# EAGLE board usg-core (EAGLE 9.5.1), part 1 of 2
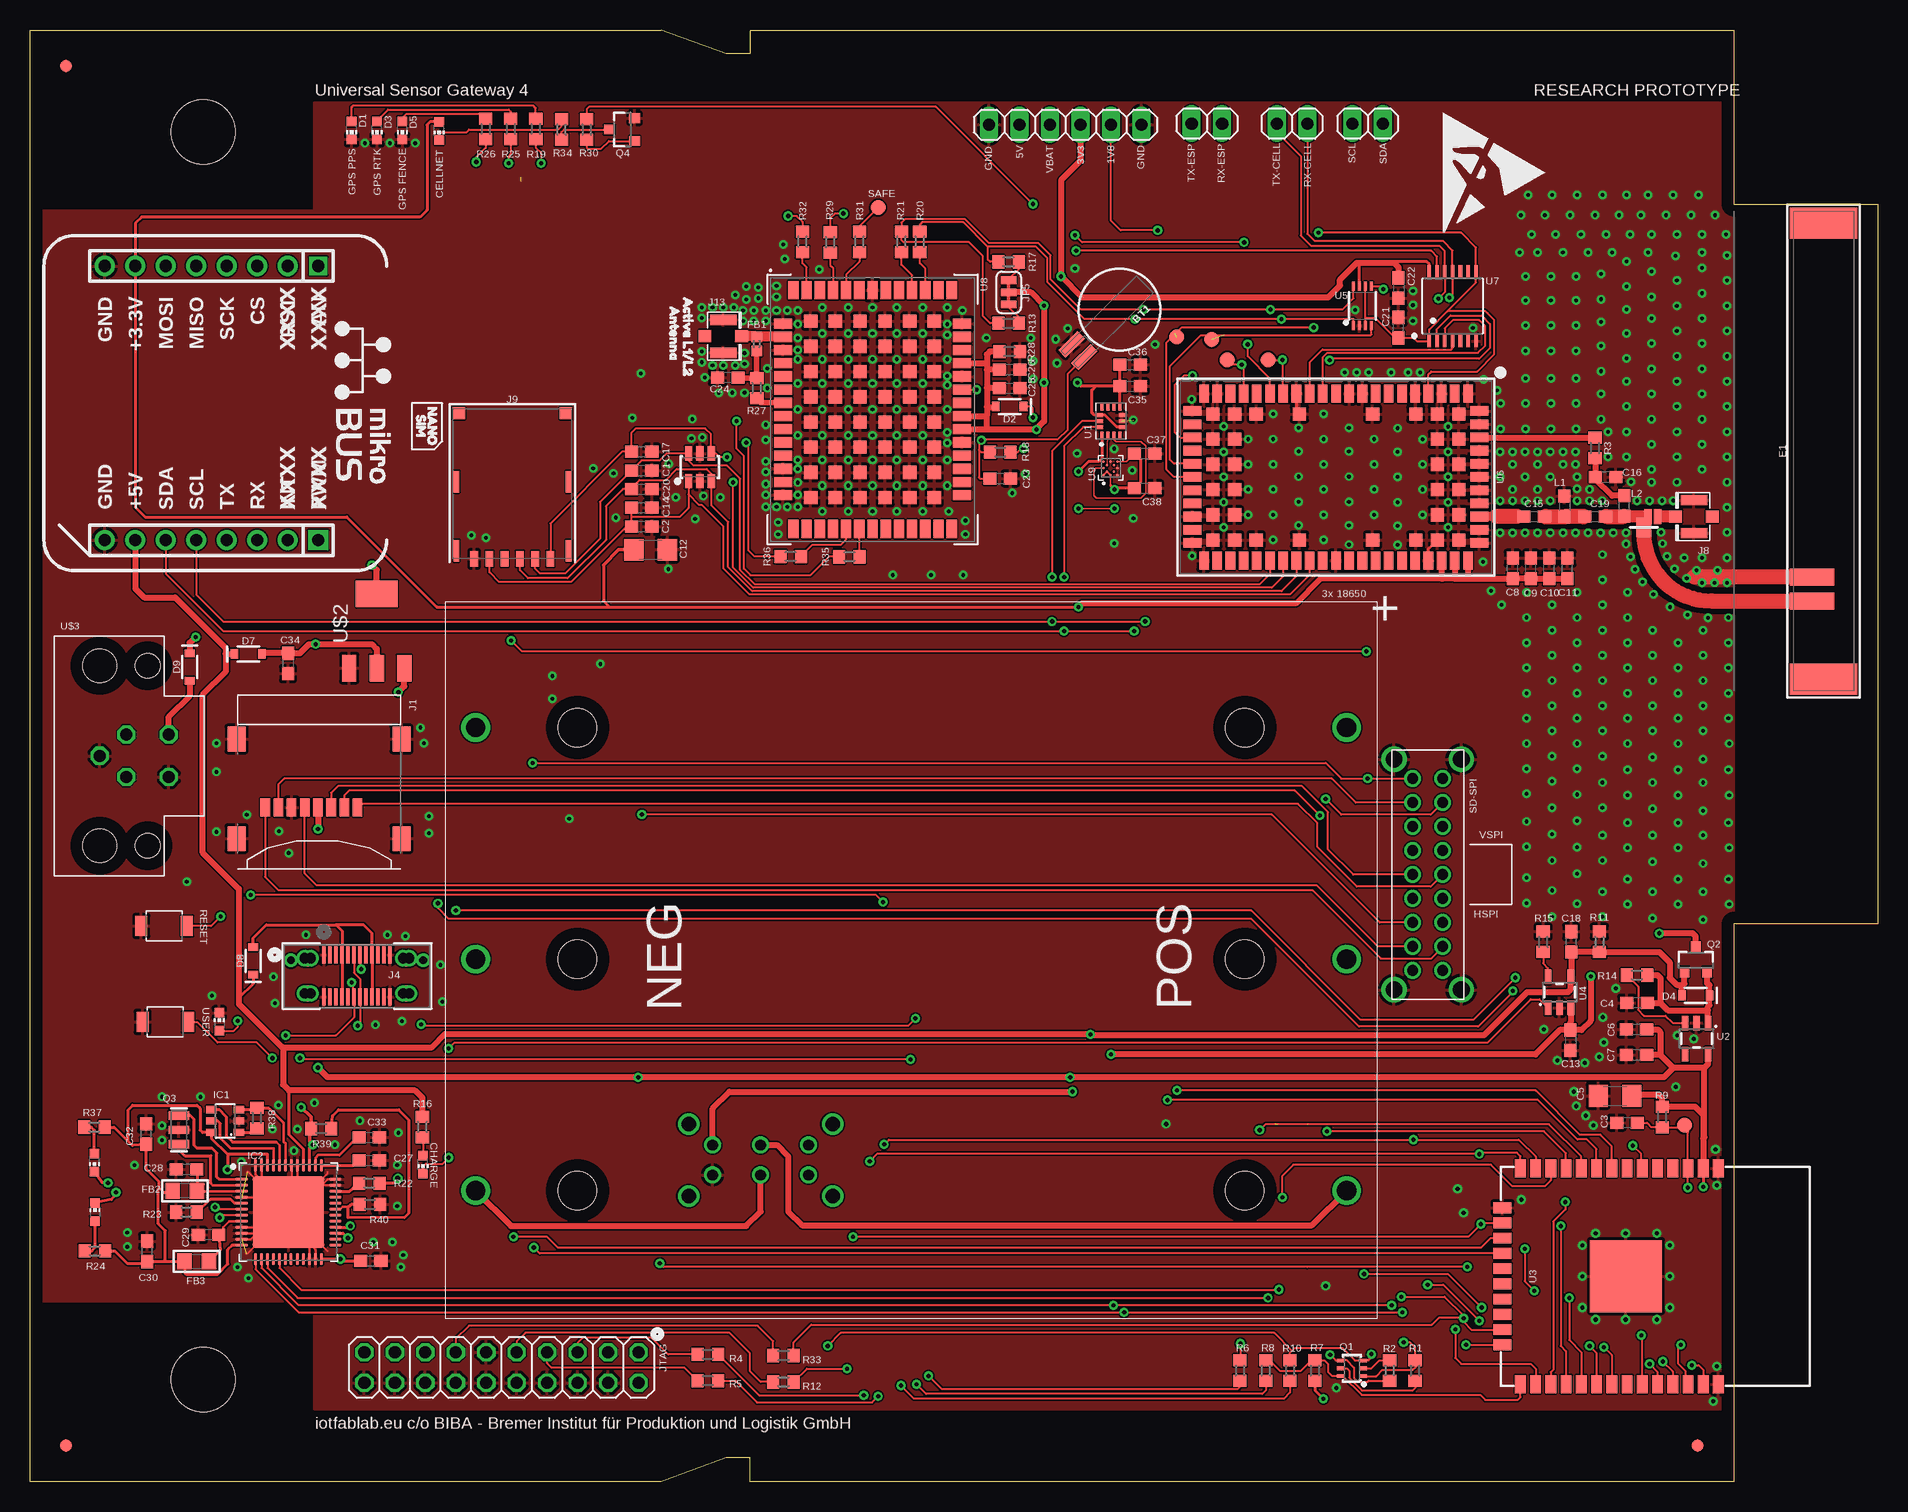
[diagram p3: board, top side]
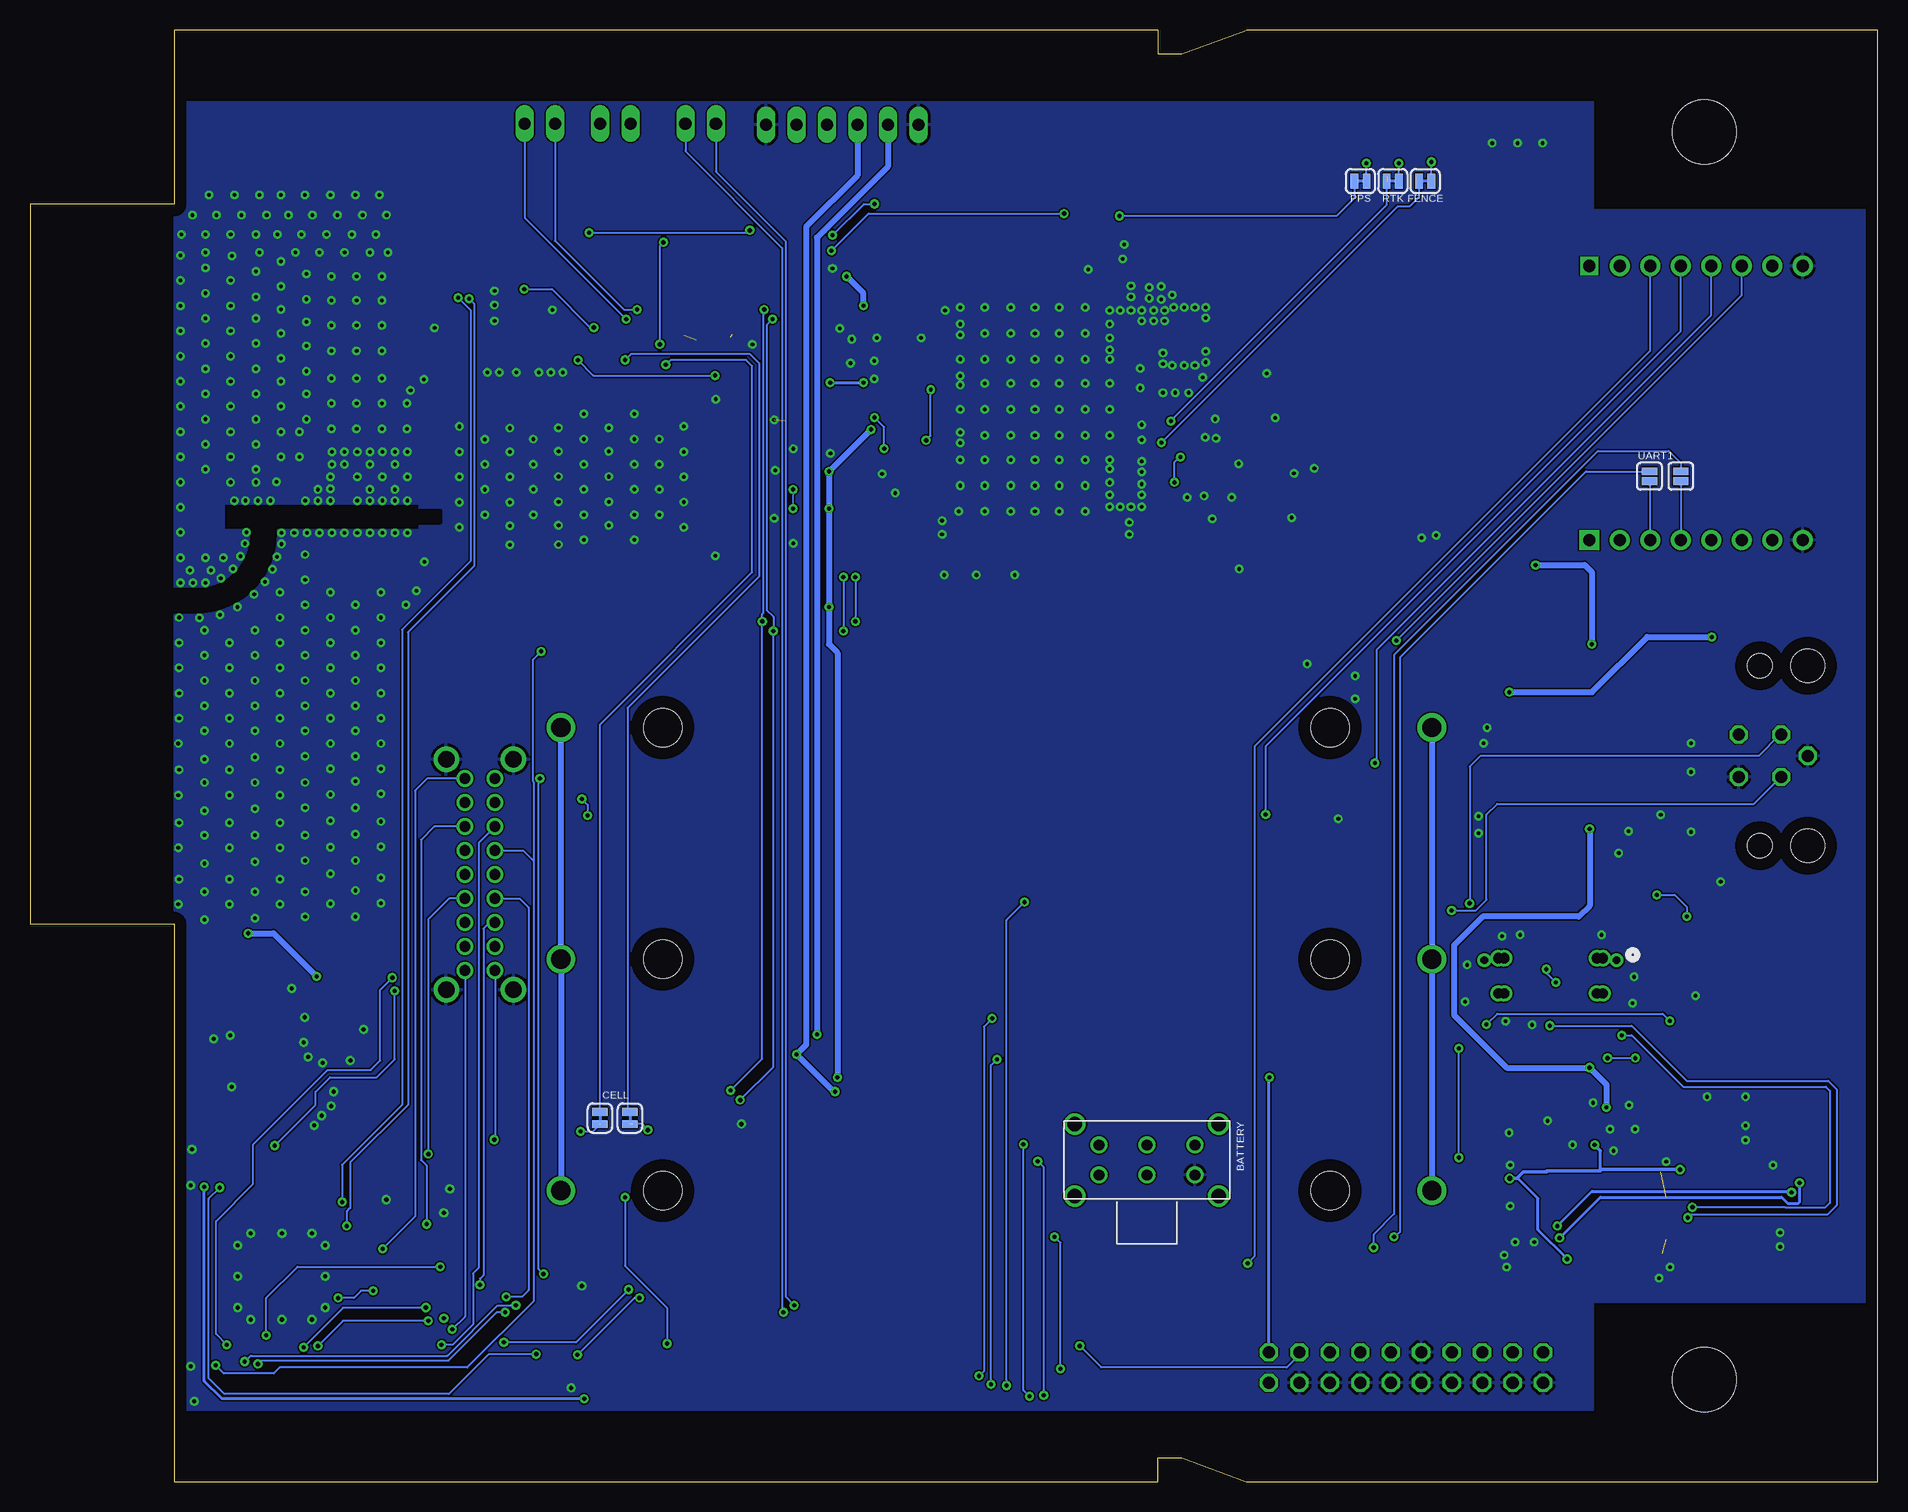
[diagram p4: board, bottom side, seen from below]

Size 154 x 121 mm. Coordinates in mm from the lower left corner, seen from the top.
Outline: 0,0 0,121 52.6,121 58,119.03 60,119.03 60,121 142,121 142,106.5 154,106.5 154,46.5 142,46.5 142,0 60,0 60,1.97 58,1.97 52.6,0 0,0
Copper layers (1*16): Top 0.035mm / dielectric 1.5mm / Bottom 0.035mm
Design rules "default *": minimum track width 3mil, minimum drill 0.3mm, track to track 5mil, track to pad 5mil, pad to pad 5mil, via to via 5mil, smd to smd 5mil, copper to edge 40mil, drill to drill 6mil, minimum pad ring 10mil, minimum via ring 8mil, stop-mask expansion 2.5mil, vias tented up to drill 20mil, thermal gap 10mil
Net classes: 1 USB_Data: width 0.127 mm, drill 0.254 mm; 2 3.3V: width 0.127 mm
Holes 5.32 mm at 14.45,8.5 14.45,112.5
tRestrict: area 56.9,94.7 to 58.3,96.2

## Footprints (pad centres in the part's own frame; a part is rotated, then mirrored left to right if it is on the bottom)
BK-18650-PC6 = drill 1.6: NEG1 75.15,29.755; NEG2 75.15,10.455; NEG3 75.15,49.055; POS1 2.55,29.755; POS2 2.55,10.455; POS3 2.55,49.055 | hole 3.2: 11.04,29.755; 66.66,29.755; 66.66,10.455; 11.04,10.455; 11.04,49.055; 66.66,49.055
SLIDE-SWITCH-DPDT = drill 1.2: MNT1 -3,-6; MNT2 3,-6; MNT3 -3,6; MNT4 3,6 | drill 0.9: P$1 -1.25,4; P$2 -1.25,0; P$3 -1.25,-4; P$4 1.25,4; P$5 1.25,0; P$6 1.25,-4
BATTCON-6.8MM = smd 2.25 x 0.85: + 4.87,0.75; - 4.87,-0.75
C0603 = smd 1.1 x 1: 1 -0.85,0; 2 0.85,0
C1206 = smd 1.6 x 1.8: 1 -1.4,0; 2 1.4,0
CHIP-LED0603 = smd 0.8 x 0.8: A 0,-0.75; C 0,0.75
SOD-323 = smd 0.63 x 0.83: A 1.15,0; C -1.15,0
SOT23-6L = smd 0.6 x 1.2: 1 -0.95,-1.15; 2 0,-1.15; 3 0.95,-1.15; 4 0.95,1.15; 5 0,1.15; 6 -0.95,1.15
MOLEX_146200 = smd 1.4 x 3.7: FEED 12.5,-0.95; GND 10.5,-0.95 | smd 2.6 x 5.6: MNT1 -19,0; MNT2 19,0
0402 = smd 0.85 x 0.9: 1 -0.58,0; 2 0.58,0
_0805 = smd 1.2 x 1.3: 1 -1.016,0; 2 1.016,0
FIDUCIAL-1X2 = smd 1 x 1: 1 0,0
SMT-JUMPER_2_NC_TRACE_SILK = smd 0.635 x 1.27: 1 -0.508,0; 2 0.508,0
1X02 = drill 1.016 long: 1 -1.27,0; 2 1.27,0
SOT23-6 = smd 0.6 x 0.9: 1 -0.95,-1.15; 2 0,-1.15; 3 0.95,-1.15; 4 0.95,1.15; 5 0,1.15; 6 -0.95,1.15
QFN48_8MM = smd 1 x 0.23: 1 -3.9,2.75; 2 -3.9,2.25; 3 -3.9,1.75; 4 -3.9,1.25; 5 -3.9,0.75; 6 -3.9,0.25; 7 -3.9,-0.25; 8 -3.9,-0.75; 9 -3.9,-1.25; 10 -3.9,-1.75; 11 -3.9,-2.25; 12 -3.9,-2.75; 25 3.9,-2.75; 26 3.9,-2.25; 27 3.9,-1.75; 28 3.9,-1.25; 29 3.9,-0.75; 30 3.9,-0.25; 31 3.9,0.25; 32 3.9,0.75; 33 3.9,1.25; 34 3.9,1.75; 35 3.9,2.25; 36 3.9,2.75 | smd 0.23 x 1: 13 -2.75,-3.9; 14 -2.25,-3.9; 15 -1.75,-3.9; 16 -1.25,-3.9; 17 -0.75,-3.9; 18 -0.25,-3.9; 19 0.2,-3.9; 20 0.75,-3.9; 21 1.25,-3.9; 22 1.75,-3.9; 23 2.25,-3.9; 24 2.75,-3.9; 37 2.75,3.9; 38 2.25,3.9; 39 1.75,3.9; 40 1.25,3.9; 41 0.75,3.9; 42 0.25,3.9; 43 -0.25,3.9; 44 -0.75,3.9; 45 -1.25,3.9; 46 -1.75,3.9; 47 -2.25,3.9; 48 -2.75,3.9 | smd 6 x 6: THERMAL 0,0
MOLEX_47219-2001 = smd 0.8 x 1.5: 1 3.2,-2.1; 2 2.1,-2.1; 3 1,-2.1; 4 -0.1,-2.1; 5 -1.2,-2.1; 6 -2.3,-2.1; 7 -3.4,-2.1; 8 -4.5,-2.1 | smd 1.5 x 2.05: G1 6.875,-4.7; G2 6.875,3.6; G3 -6.875,3.6; G4 -6.875,-4.7
CONN_DX07S024WJ3R400 = drill 0.635 pad 0.635: 25 -8.255,3.048; 26 2.769,3.048 | smd 1.858 x 1.358: 27 -6.85,3.22; 28 1.35,3.22; 29 -6.85,0.28; 30 1.35,0.28 | drill 0.838 pad 0.838: 31 -7.112,3.226; 32 -6.604,3.226; 33 1.092,3.226; 34 1.6,3.226; 35 -7.112,0.279; 36 -6.604,0.279; 37 1.092,0.279; 38 1.6,0.279 | smd 0.305 x 1.397: A1 -5.5,3.5; A2 -5,3.5; A3 -4.5,3.5; A4 -4,3.5; A5 -3.5,3.5; A6 -3,3.5; A7 -2.5,3.5; A8 -2,3.5; A9 -1.5,3.5; A10 -1,3.5; A11 -0.5,3.5; A12 0,3.5; B1 0,0; B2 -0.5,0; B3 -1,0; B4 -1.5,0; B5 -2,0; B6 -2.5,0; B7 -3,0; B8 -3.5,0; B9 -4,0; B10 -4.5,0; B11 -5,0; B12 -5.5,0
U.FL = smd 2.2 x 0.85: 1 0,1.375; 2 0,-1.375 | smd 1.05 x 1: FEED 1.525,0; NC -1.525,0
NANO_SIM_WURTH_693043020611 = smd 0.65 x 1.3: C1 1.905,6.25; C2 -0.635,6.25; C3 -1.905,6.25; C5 3.175,6.25; C6 0.635,6.25; C7 -3.175,6.25 | smd 0.48 x 1.8: MNT1 -4.69,5.58; MNT2 4.66,5.58; MNT3 -4.69,-0.17; MNT4 4.66,-0.17 | smd 1.03 x 1: MNT5 -4.465,-5.89; MNT6 4.465,-5.89
SMT-JUMPER_3_2-NC_TRACE_SILK = smd 0.635 x 1.27: 1 -1.016,0; 2 0,0; 3 1.016,0
SMT-JUMPER_2_NC_TRACE_NO-SILK = smd 0.635 x 1.27: 1 -0.508,0; 2 0.508,0
SMT-JUMPER_2_NO_NO-SILK = smd 0.635 x 1.27: 1 -0.406,0; 2 0.406,0
2X10 = drill 1.016 octagon: 1 -11.43,-1.27; 2 -11.43,1.27; 3 -8.89,-1.27; 4 -8.89,1.27; 5 -6.35,-1.27; 6 -6.35,1.27; 7 -3.81,-1.27; 8 -3.81,1.27; 9 -1.27,-1.27; 10 -1.27,1.27; 11 1.27,-1.27; 12 1.27,1.27; 13 3.81,-1.27; 14 3.81,1.27; 15 6.35,-1.27; 16 6.35,1.27; 17 8.89,-1.27; 18 8.89,1.27; 19 11.43,-1.27; 20 11.43,1.27
0603 = smd 1.1 x 1: 1 -0.85,0; 2 0.85,0
MIKROBUS = drill 1.016 square: 1 -11.43,7.62 | drill 1.016 pad 1.676: 2 -11.43,5.08; 3 -11.43,2.54; 4 -11.43,0; 5 -11.43,-2.54; 6 -11.43,-5.08; 7 -11.43,-7.62; 8 -11.43,-10.16; 9 11.43,-10.16; 10 11.43,-7.62; 11 11.43,-5.08; 12 11.43,-2.54; 13 11.43,0; 14 11.43,2.54; 15 11.43,5.08 | drill 1.016 pad 1.676 square: 16 11.43,7.62
1X06 = drill 1.016 long: 1 -6.35,0; 2 -3.81,0; 3 -1.27,0; 4 1.27,0; 5 3.81,0; 6 6.35,0
SC70-6 = smd 0.3 x 0.66: 1 -0.65,-0.92; 2 0,-0.92; 3 0.65,-0.92; 4 0.65,0.92; 5 0,0.92; 6 -0.65,0.92
SOT23-3@1 = smd 0.8 x 0.9: 1 -0.95,-1; 2 0.95,-1; 3 0,1.1
RESONATOR-SMD = smd 0.7 x 1.7: 1 -1.2,0; 2 0,0; 3 1.2,0
SOT23-3 = smd 0.8 x 0.9: 1 -0.95,-1; 2 0.95,-1; 3 0,1.1
R0603 = smd 1 x 1.1: 1 -0.85,0; 2 0.85,0
B1,27 = smd 1.27 x 1.27: TP 0,0
SLIDE-SWITCH-6PDT = drill 1.4: MNT1 -2.8,-9.6; MNT2 2.8,-9.6; MNT3 -2.8,9.6; MNT4 2.8,9.6 | drill 0.9: P$1 -1.25,-8; P$2 -1.25,-6; P$3 -1.25,-4; P$4 -1.25,-2; P$5 -1.25,0; P$6 -1.25,2; P$7 -1.25,4; P$8 -1.25,6; P$9 -1.25,8; P$10 1.25,-8; P$11 1.25,-6; P$12 1.25,-4; P$13 1.25,-2; P$14 1.25,0; P$15 1.25,2; P$16 1.25,4; P$17 1.25,6; P$18 1.25,8
SMT-JUMPER_2_NO_SILK = smd 0.635 x 1.27: 1 -0.406,0; 2 0.406,0
SW2-2.6-3.0X2.5X1.2+0.4MM = smd 1 x 1.7: 1 -1.9,0; 2 1.9,0
PQFN50P300X250X88-14N = smd 0.59 x 0.35: 1 -1.165,0.75; 2 -1.165,0.25; 3 -1.165,-0.25; 4 -1.165,-0.75; 8 1.165,-0.75; 9 1.165,-0.25; 10 1.165,0.25; 11 1.165,0.75 | smd 0.35 x 0.59: 5 -0.5,-0.915; 6 0,-0.915; 7 0.5,-0.915; 12 0.5,0.915; 13 0,0.915; 14 -0.5,0.915
SOT23-5 = smd 0.55 x 1.2: 1 -0.95,-1.3; 2 0,-1.3; 3 0.95,-1.3; 4 0.95,1.3; 5 -0.95,1.3
ESP-WROOM-32 = smd 0.9 x 1.5: 1 7.7,9; 2 6.43,9; 3 5.16,9; 4 3.89,9; 5 2.62,9; 6 1.35,9; 7 0.08,9; 8 -1.19,9; 9 -2.46,9; 10 -3.73,9; 11 -5,9; 12 -6.27,9; 13 -7.54,9; 14 -8.81,9; 25 -8.81,-9; 26 -7.54,-9; 27 -6.27,-9; 28 -5,-9; 29 -3.73,-9; 30 -2.46,-9; 31 -1.19,-9; 32 0.08,-9; 33 1.35,-9; 34 2.62,-9; 35 3.89,-9; 36 5.16,-9; 37 6.43,-9; 38 7.7,-9 | smd 1.5 x 0.9: 15 -10.3,5.715; 16 -10.3,4.445; 17 -10.3,3.175; 18 -10.3,1.905; 19 -10.3,0.635; 20 -10.3,-0.635; 21 -10.3,-1.905; 22 -10.3,-3.175; 23 -10.3,-4.445; 24 -10.3,-5.715 | smd 6 x 6: GND 0,0
VSSOP-8 = smd 0.75 x 0.25: 1 -1.65,0.75; 2 -1.65,0.25; 3 -1.65,-0.25; 4 -1.65,-0.75; 5 1.65,-0.75; 6 1.65,-0.25; 7 1.65,0.25; 8 1.65,0.75
SARA-LGA = smd 0.8 x 1.5: 1 -11,-6.95; 2 -9.9,-6.95; 3 -8.8,-6.95; 4 -7.7,-6.95; 5 -6.6,-6.95; 6 -5.5,-6.95; 7 -4.4,-6.95; 8 -3.3,-6.95; 9 -2.2,-6.95; 10 -1.1,-6.95; 11 0,-6.95; 12 1.1,-6.95; 13 2.2,-6.95; 14 3.3,-6.95; 15 4.4,-6.95; 16 5.5,-6.95; 17 6.6,-6.95; 18 7.7,-6.95; 19 8.8,-6.95; 20 9.9,-6.95; 21 11,-6.95; 33 11,6.95; 34 9.9,6.95; 35 8.8,6.95; 36 7.7,6.95; 37 6.6,6.95; 38 5.5,6.95; 39 4.4,6.95; 40 3.3,6.95; 41 2.2,6.95; 42 1.1,6.95; 43 0,6.95; 44 -1.1,6.95; 45 -2.2,6.95; 46 -3.3,6.95; 47 -4.4,6.95; 48 -5.5,6.95; 49 -6.6,6.95; 50 -7.7,6.95; 51 -8.8,6.95; 52 -9.9,6.95; 53 -11,6.95 | smd 1.5 x 0.8: 22 11.95,-5.5; 23 11.95,-4.4; 24 11.95,-3.3; 25 11.95,-2.2; 26 11.95,-1.1; 27 11.95,0; 28 11.95,1.1; 29 11.95,2.2; 30 11.95,3.3; 31 11.95,4.4; 32 11.95,5.5; 54 -11.95,5.5; 55 -11.95,4.4; 56 -11.95,3.3; 57 -11.95,2.2; 58 -11.95,1.1; 59 -11.95,0; 60 -11.95,-1.1; 61 -11.95,-2.2; 62 -11.95,-3.3; 63 -11.95,-4.4; 64 -11.95,-5.5 | smd 1.1 x 1.1: 65 -10.25,-5.25; 66 -10.25,-3.15; 67 -10.25,-1.05; 68 -10.25,1.05; 69 -10.25,3.15; 70 -10.25,5.25; 71 -8.45,-5.25; 72 -8.45,-3.15; 73 -8.45,-1.05; 74 -8.45,1.05; 75 -8.45,3.15; 76 -8.45,5.25; 77 -6.65,-5.25; 78 -6.65,5.25; 79 -3.05,-5.25; 80 -3.05,5.25; 81 3.05,-5.25; 82 3.05,5.25; 83 6.65,-5.25; 84 6.65,5.25; 85 8.45,-5.25; 86 8.45,-3.15; 87 8.45,-1.05; 88 8.45,1.05; 89 8.45,3.15; 90 8.45,5.25; 91 10.25,-5.25; 92 10.25,-3.15; 93 10.25,-1.05; 94 10.25,1.05; 95 10.25,3.15; 96 10.25,5.25
TSSOP14 = smd 0.305 x 0.991: 1 -1.95,-2.918; 2 -1.3,-2.918; 3 -0.65,-2.918; 4 0,-2.918; 5 0.65,-2.918; 6 1.3,-2.918; 7 1.95,-2.918; 8 1.95,2.918; 9 1.3,2.918; 10 0.65,2.918; 11 0,2.918; 12 -0.65,2.918; 13 -1.3,2.918; 14 -1.95,2.918
ZED-F9P = smd 0.85 x 1.52: 1 -7.15,-7.45; 2 -6.05,-7.45; 3 -4.95,-7.45; 4 -3.85,-7.45; 5 -2.75,-7.45; 6 -1.65,-7.45; 7 -0.55,-7.45; 8 0.55,-7.45; 9 1.65,-7.45; 10 2.75,-7.45; 11 3.85,-7.45; 12 4.95,-7.45; 13 6.05,-7.45; 14 7.15,-7.45; 28 7.15,7.45; 29 6.05,7.45; 30 4.95,7.45; 31 3.85,7.45; 32 2.75,7.45; 33 1.65,7.45; 34 0.55,7.45; 35 -0.55,7.45; 36 -1.65,7.45; 37 -2.75,7.45; 38 -3.85,7.45; 39 -4.95,7.45; 40 -6.05,7.45; 41 -7.15,7.45 | smd 1.52 x 0.85: 15 9.95,-6.6; 16 9.95,-5.5; 17 9.95,-4.4; 18 9.95,-3.3; 19 9.95,-2.2; 20 9.95,-1.1; 21 9.95,0; 22 9.95,1.1; 23 9.95,2.2; 24 9.95,3.3; 25 9.95,4.4; 26 9.95,5.5; 27 9.95,6.6; 42 -9.95,6.6; 43 -9.95,5.5; 44 -9.95,4.4; 45 -9.95,3.3; 46 -9.95,2.2; 47 -9.95,1.1; 48 -9.95,0; 49 -9.95,-1.1; 50 -9.95,-2.2; 51 -9.95,-3.3; 52 -9.95,-4.4; 53 -9.95,-5.5; 54 -9.95,-6.6 | smd 1.1 x 1.1: 55 -1.05,-1.05; 56 -3.15,-1.05; 57 -5.25,-1.05; 58 -7.35,-1.05; 59 -1.05,-3.1; 60 -3.15,-3.1; 61 -5.25,-3.1; 62 -7.35,-3.1; 63 -1.05,-5.15; 64 -3.15,-5.15; 65 -5.25,-5.15; 66 -7.35,-5.15; 67 -1.05,5.15; 68 -3.15,5.15; 69 -5.25,5.15; 70 -7.35,5.15; 71 -1.05,3.1; 72 -3.15,3.1; 73 -5.25,3.1; 74 -7.35,3.1; 75 -1.05,1.05; 76 -3.15,1.05; 77 -5.25,1.05; 78 -7.35,1.05; 79 1.05,1.05; 80 3.15,1.05; 81 5.25,1.05; 82 7.35,1.05; 83 1.05,3.1; 84 3.15,3.1; 85 5.25,3.1; 86 7.35,3.1; 87 1.05,5.15; 88 3.15,5.15; 89 5.25,5.15; 90 7.35,5.15; 91 1.05,-5.15; 92 3.15,-5.15; 93 5.25,-5.15; 94 7.35,-5.15; 95 1.05,-3.1; 96 3.15,-3.1; 97 5.25,-3.1; 98 7.35,-3.1; 99 1.05,-1.05; 100 3.15,-1.05; 101 5.25,-1.05; 102 7.35,-1.05
XDCR_BMM150 = smd 0.2 x 0.2: A1 -0.601,0.601; A3 -0.035,0.601; A5 0.531,0.601; B2 -0.318,0.318; B4 0.248,0.318; C1 -0.601,0.035; C5 0.531,0.035; D2 -0.318,-0.248; D4 0.248,-0.248; E1 -0.601,-0.531; E3 -0.035,-0.531; E5 0.531,-0.531
SOT223 = smd 3.5 x 2.2: P$1 0,3.1 | smd 1.2 x 2.2: P$2 -2.3,-3.1; P$3 0,-3.1; P$4 2.3,-3.1
SACC-CI-M12FSD-4CON-L90 = drill 1 octagon: PIN1 -1.77,9.57; PIN2 1.77,9.57; PIN3 1.77,6.03; PIN4 -1.77,6.03; SHIELD 0,3.8 | hole 2.8: -7.5,3.8; 7.5,3.8 | hole 2.05: -7.5,7.8; 7.5,7.8

## Placement (x,y rotation side)
BAT  3x 18650  [BK-18650-PC6]  112.3,73.3 180 top
BATTERY  SLIDE-SWITCH-DPDT  [SLIDE-SWITCH-DPDT]  60.9,26.8 270 bottom
BT1  6.8MM_COIN_CELL  [BATTCON-6.8MM]  90.8,97.7 225 top
C1  47pF  [C0603]  50.98,84.29 0 top
C2  0.1uF  [C0603]  50.98,79.62 0 top
C3  10uF  [C0603]  133.12,29.9 180 top
C4  1uF  [C0603]  133.95,39.91 180 top
C5  100uF  [C1206]  132.12,32.15 0 top
C6  1uF  [C0603]  133.91,37.68 180 top
C7  10uF  [C0603]  133.91,35.56 180 top
C8  0.1uF  [C0603]  123.59,76.12 90 top
C9  10nF  [C0603]  125.12,76.12 90 top
C10  15pF  [C0603]  126.64,76.12 90 top
C11  68pF  [C0603]  128.16,76.12 90 top
C12  100uF  [C1206]  51.73,77.68 0 top
C13  4.7uF  [C0603]  128.41,36.78 270 top
C14  47pF  [C0603]  50.98,81.18 0 top
C15  15pF  [C0603]  125.37,80.44 0 top
C16  27pF  [C0603]  131.34,83.74 0 top
C17  47pF  [C0603]  50.98,85.85 0 top
C18  4.7uF  [C0603]  128.47,44.99 90 top
C19  33pF  [C0603]  130.45,80.44 0 top
C20  47pF  [C0603]  50.98,82.73 0 top
C21  0.1uF  [C0603]  114.08,96.19 90 top
C22  0.1uF  [C0603]  114.08,99.49 270 top
C23  1.0uF  [C0603]  80.88,83.62 0 top
C24  47pF  [C0603]  58.16,92.04 180 top
C25  1.0uF  [C0603]  81.66,91.15 0 top
C26  0.1uF  [C0603]  81.66,92.67 180 top
C27  0.1uF  [C0603]  28.28,26.77 0 top
C28  10uF  [C0603]  13.04,26.01 180 top
C29  10uF  [C0603]  14.89,20.56 180 top
C30  10uF  [C0603]  9.77,19.19 90 top
C31  0.1uF  [C0603]  28.41,18.39 0 top
C32  0.1uF  [C0603]  9.68,28.97 90 top
C33  0.1uF  [C0603]  28.28,28.68 0 top
C34  10uF  [C0603]  21.5,68.2 270 top
C35  0.1uF  [C0603]  91.7,91.3 0 top
C36  0.1uF  [C0603]  91.7,93.1 0 top
C37  0.1uF  [C0603]  92.9,85.7 0 top
C38  0.1uF  [C0603]  92.9,82.8 0 top
CELLNET  blue  [CHIP-LED0603]  34.1,112.6 180 top
D1  blue  [CHIP-LED0603]  26.81,112.63 180 top
D2  1A/23V  [SOD-323]  81.66,89.62 180 top
D3  blue  [CHIP-LED0603]  28.93,112.63 180 top
D4  1A/23V  [SOD-323]  138.85,40.51 180 top
D5  blue  [CHIP-LED0603]  31.04,112.63 180 top
D6  DT1042-04SO-7  [SOT23-6L]  55.83,84.55 0 top
D7  1A/23V  [SOD-323]  18.2,69 0 top
D8  1A/23V  [SOD-323]  18.6,43.4 90 top
D9  1A/23V  [SOD-323]  13.3,67.9 270 top
D-CHG  blue  [CHIP-LED0603]  32.76,26.43 180 top
E1  MOLEX-146200  [MOLEX_146200]  149.5,85.9 270 top
FB1  FERRITE_BEAD-120_OHM-0402  [0402]  60.58,94.83 270 top
FB2  Ferrite  [_0805]  12.91,24.23 180 top
FB3  Ferrite  [_0805]  13.9,18.35 0 top
FD1  FIDUCIAL1X2  [FIDUCIAL-1X2]  3,118 0 top
FD2  FIDUCIAL1X2  [FIDUCIAL-1X2]  3,3 0 top
FD3  FIDUCIAL1X2  [FIDUCIAL-1X2]  139,3 0 top
FENCE  JUMPER-SMT_2_NC_TRACE_SILK  [SMT-JUMPER_2_NC_TRACE_SILK]  37.7,108.4 180 bottom
I2C  [1X02]  111.5,113.2 0 top
IC1  93LC56B  [SOT23-6]  16.27,30.05 90 top
IC2  FT232HQ  [QFN48_8MM]  21.55,22.45 0 top
J1  47219-2001  [MOLEX_47219-2001]  24.1,58.3 0 top
J4  DX07S024WJ3R400  [CONN_DX07S024WJ3R400]  30,40.4 0 top
J8  U.FL  [U.FL]  138.71,80.44 180 top
J9  NANO_SIM  [NANO_SIM_WURTH_693043020611]  40.2,83.17 180 top
J13  U.FL  [U.FL]  57.78,95.47 0 top
JP5  [SMT-JUMPER_3_2-NC_TRACE_SILK]  81.58,99.13 270 top
JP7  J-CHIP  [SMT-JUMPER_2_NC_TRACE_NO-SILK]  134.51,79.55 270 top
JP8  J-U.FL  [SMT-JUMPER_2_NO_NO-SILK]  135.28,80.44 0 top
JP10  JUMPER-SMT_2_NC_TRACE_SILK  [SMT-JUMPER_2_NC_TRACE_SILK]  104,30.3 270 bottom
JP11  JUMPER-SMT_2_NC_TRACE_SILK  [SMT-JUMPER_2_NC_TRACE_SILK]  106.5,30.3 270 bottom
JTAG  [2X10]  39.3,9.5 180 top
L1  39nH  [0603]  127.91,81.29 270 top
L2  68nH  [0603]  132.9,81.33 90 top
LED1  blue  [CHIP-LED0603]  15.78,38.32 0 top
MB1  MIKROBUS  [MIKROBUS]  16.4,89.9 270 top
POWER  [1X06]  86.3,113.1 0 top
PPS  JUMPER-SMT_2_NC_TRACE_SILK  [SMT-JUMPER_2_NC_TRACE_SILK]  43.1,108.4 180 bottom
Q1  MBT3904DW1T1  [SC70-6]  110.18,9.43 90 top
Q2  2.5A/30V  [SOT23-3@1]  138.85,43.46 0 top
Q3  CSTCR 12MHz  [RESONATOR-SMD]  12.4,29.31 270 top
Q4  600mA/40V  [SOT23-3]  49.4,112.7 90 top
R1  10k  [R0603]  115.46,9.25 270 top
R2  10k  [R0603]  113.34,9.25 90 top
R3  10k  [R0603]  130.45,86.15 270 top
R4  100  [R0603]  56.5,10.6 0 top
R5  100  [R0603]  56.5,8.4 0 top
R6  1k  [R0603]  100.86,9.25 90 top
R7  1k  [R0603]  107.12,9.25 270 top
R8  47  [R0603]  103.01,9.25 90 top
R9  1k  [R0603]  136.05,30.39 90 top
R10  47  [R0603]  105.03,9.25 90 top
R11  10k  [R0603]  130.82,44.99 270 top
R12  100  [R0603]  62.8,8.3 0 top
R13  2k2  [R0603]  81.58,96.56 0 top
R14  100k  [R0603]  133.95,42.21 180 top
R15  2k  [R0603]  126.13,44.99 270 top
R16  1k  [R0603]  32.71,29.55 270 top
R17  2k2  [R0603]  81.58,101.67 0 top
R18  1k  [R0603]  80.88,85.81 0 top
R19  1k  [R0603]  42.16,112.75 270 top
R20  33  [R0603]  74.17,103.34 90 top
R21  33  [R0603]  72.64,103.34 90 top
R22  12k  [R0603]  28.28,24.86 0 top
R23  12k  [R0603]  13.04,22.45 180 top
R24  1k  [R0603]  5.4,19.23 180 top
R25  1k  [R0603]  40.07,112.75 270 top
R26  1k  [R0603]  37.98,112.75 270 top
R27  10  [R0603]  60.58,91.15 270 top
R28  100k  [R0603]  81.66,94.2 180 top
R29  33  [R0603]  66.7,103.3 90 top
R30  10k  [R0603]  46.4,112.7 270 top
R31  33  [R0603]  69.14,103.34 90 top
R32  33  [R0603]  64.39,103.34 90 top
R33  100  [R0603]  62.8,10.5 0 top
R34  1k  [R0603]  44.3,112.7 270 top
R35  33  [R0603]  68.3,77.09 180 top
R36  33  [R0603]  63.4,77.11 180 top
R37  1k  [R0603]  5.36,29.53 180 top
R38  2k2  [R0603]  18.91,30.3 270 top
R39  4k7  [R0603]  24.27,29.42 180 top
R40  12k  [R0603]  28.33,23.09 180 top
RTK  JUMPER-SMT_2_NC_TRACE_SILK  [SMT-JUMPER_2_NC_TRACE_SILK]  40.4,108.4 180 bottom
RX  blue  [CHIP-LED0603]  5.37,26.6 180 top
SAFE  PTR1B1,27  [B1,27]  70.7,106.2 0 top
SD-SPI  EG1925-ND  [SLIDE-SWITCH-6PDT]  116.5,50.6 0 top
SJ1  JUMPER-SMT_2_NO_SILK  [SMT-JUMPER_2_NO_SILK]  19,83.8 90 bottom
SJ2  JUMPER-SMT_2_NO_SILK  [SMT-JUMPER_2_NO_SILK]  16.4,83.8 90 bottom
SW1  [SW2-2.6-3.0X2.5X1.2+0.4MM]  11.28,38.31 0 top
SW2  [SW2-2.6-3.0X2.5X1.2+0.4MM]  11.18,46.31 0 top
TP1  PTR1B1,27  [B1,27]  137.9,29.7 0 top
TP2  PTR1B1,27  [B1,27]  103.2,93.5 0 top
TP3  PTR1B1,27  [B1,27]  99.8,93.5 0 top
TP4  PTR1B1,27  [B1,27]  95.6,95.4 0 top
TP5  PTR1B1,27  [B1,27]  98.5,95.2 0 top
TX  blue  [CHIP-LED0603]  5.41,22.47 0 top
U1  BMI160  [PQFN50P300X250X88-14N]  90.1,88.4 90 top
U2  AP2112K-3.3V  [SOT23-5]  138.91,36.91 180 top
U3  ESP-WROOM-32  [ESP-WROOM-32]  133.04,17.11 0 top
U4  MCP73831  [SOT23-5]  127.49,40.79 0 top
U5  TCA9406DCU  [VSSOP-8]  111.08,97.99 90 top
U6  SARA-R410M-2B  [SARA-LGA]  108.86,83.74 180 top
U7  TXB0104  [TSSOP14]  118.58,97.99 0 top
U8  ZED-F9P  [ZED-F9P]  70.23,89.37 270 top
U9  BMM150  [XDCR_BMM150]  90.1,84.5 90 top
U$1  [ESD_10.00]  117.7,114.2 270 top
U$2  LDO-AZ1117I  [SOT223]  28.9,70.9 0 top
U$3  SACC-CI-M12FSD-4CON-L90  [SACC-CI-M12FSD-4CON-L90]  2,60.5 270 top
U$54  [NANO50]  33.54,90.3 270 top
U$55  [SIM51]  32.59,89.61 270 top
U$65  [ACTIVE_L1#L21]  54.86,99.4 270 top
U$71  [ANTENNA2]  53.72,98.64 270 top
UART-1  [1X02]  98.1,113.2 0 top
UART-2  [1X02]  105.2,113.2 0 top